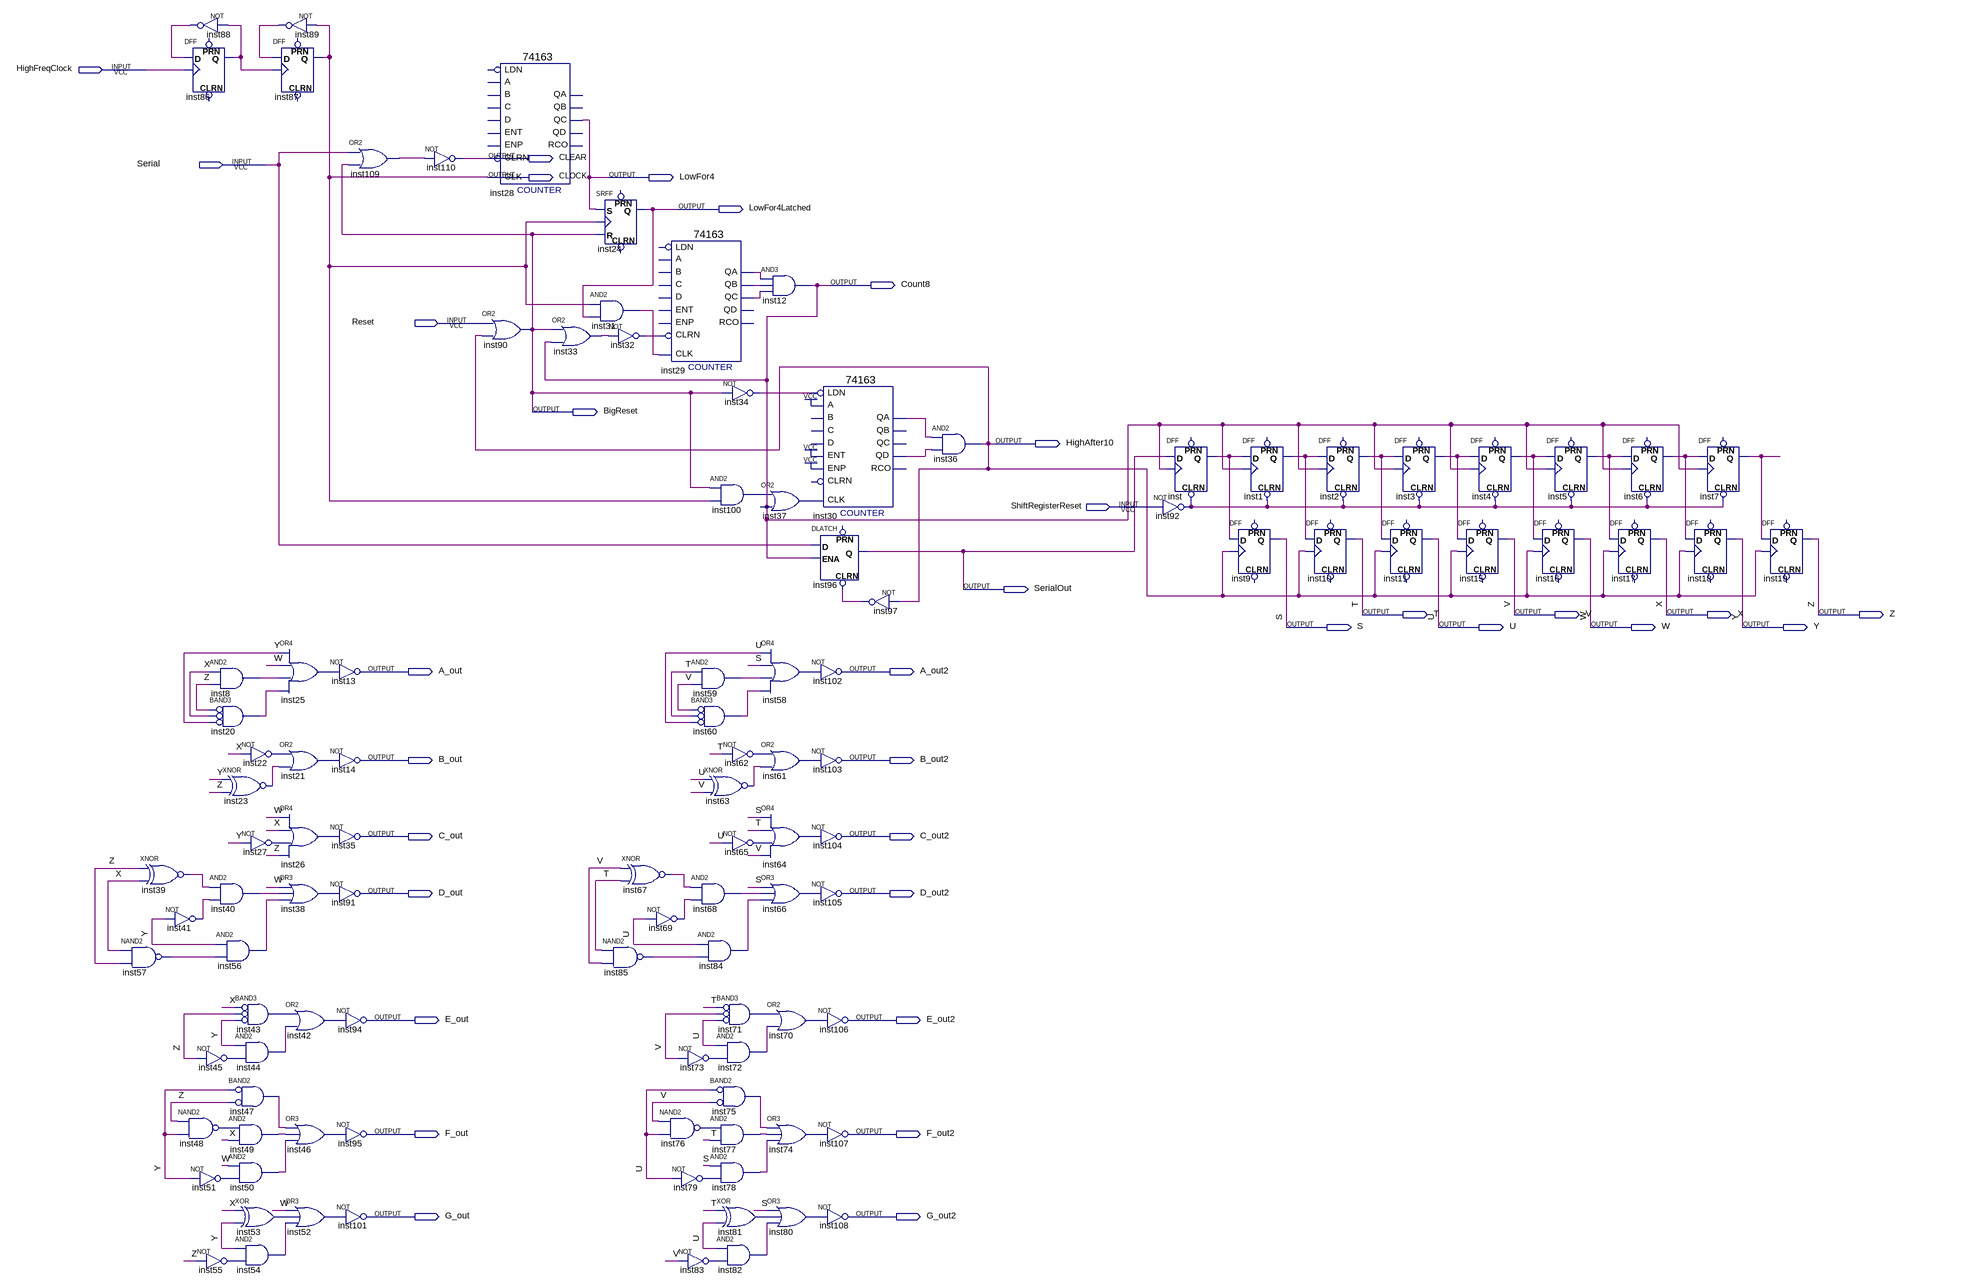
[diagram p0: schematic sheet]
// Quartus schematic WholeThing.bdf as structural Verilog: 108 symbols, 34 pins
module WholeThing (
  input  HighFreqClock,
  input  Serial,
  input  Reset,
  input  ShiftRegisterReset,
  output CLEAR,
  output CLOCK,
  output LowFor4,
  output LowFor4Latched,
  output Count8,
  output BigReset,
  output HighAfter10,
  output SerialOut,
  output T,
  output V,
  output X,
  output Z,
  output S,
  output U,
  output W,
  output Y,
  output A_out,
  output A_out2,
  output B_out,
  output B_out2,
  output C_out,
  output C_out2,
  output D_out,
  output D_out2,
  output E_out,
  output E_out2,
  output F_out,
  output F_out2,
  output G_out,
  output G_out2
);

  wire inst1_q, inst2_q, inst3_q, inst4_q, inst5_q, inst6_q, inst7_q, inst8_out, inst20_out, inst21_out,
       inst22_out, inst23_out, inst25_out, inst26_out, inst27_out, inst29_qa, inst29_qb, inst29_qc,
       inst30_qa, inst30_qd, inst31_out, inst32_out, inst33_out, inst34_out, inst37_out, inst38_out,
       inst39_out, inst40_out, inst41_out, inst42_out, inst43_out, inst44_out, inst45_out, inst46_out,
       inst47_out, inst48_out, inst49_out, inst50_out, inst51_out, inst52_out, inst53_out, inst54_out,
       inst55_out, inst56_out, inst57_out, inst58_out, inst59_out, inst60_out, inst61_out, inst62_out,
       inst63_out, inst64_out, inst65_out, inst66_out, inst67_out, inst68_out, inst69_out, inst70_out,
       inst71_out, inst72_out, inst73_out, inst74_out, inst75_out, inst76_out, inst77_out, inst78_out,
       inst79_out, inst80_out, inst81_out, inst82_out, inst83_out, inst84_out, inst85_out, inst86_q,
       inst88_out, inst89_out, inst92_out, inst97_out, inst100_out, inst109_out, inst_q;

  xnor inst39 (inst39_out, Z, X);
  nand inst57 (inst57_out, X, Z);
  not inst88 (inst88_out, inst86_q);
  DFF inst86 (.CLK(HighFreqClock), .D(inst88_out), .Q(inst86_q));  // open: CLRN, PRN
  not inst41 (inst41_out, Y);
  nand inst48 (inst48_out, Z, Y);
  not inst51 (inst51_out, Y);
  and inst8 (inst8_out, X, Z);
  and inst20 (inst20_out, ~Z, ~X, ~Y);  // BAND3
  not inst22 (inst22_out, X);
  xnor inst23 (inst23_out, Y, Z);
  not inst27 (inst27_out, Y);
  and inst40 (inst40_out, inst39_out, inst41_out);
  and inst56 (inst56_out, Y, inst57_out);
  and inst43 (inst43_out, ~X, ~Z, ~Y);  // BAND3
  and inst44 (inst44_out, Y, inst45_out);
  not inst45 (inst45_out, Z);
  and inst47 (inst47_out, ~Y, ~Z);  // BAND2
  and inst49 (inst49_out, inst48_out, X);
  and inst50 (inst50_out, W, inst51_out);
  xor inst53 (inst53_out, X, Y);
  and inst54 (inst54_out, Y, inst55_out);
  not inst55 (inst55_out, Z);
  not inst89 (inst89_out, CLOCK);
  DFF inst87 (.CLK(inst86_q), .D(inst89_out), .Q(CLOCK));  // open: CLRN, PRN
  or inst25 (inst25_out, Y, W, inst8_out, inst20_out);
  or inst21 (inst21_out, inst22_out, inst23_out);
  or inst26 (inst26_out, W, X, inst27_out, Z);
  or inst38 (inst38_out, W, inst40_out, inst56_out);
  or inst42 (inst42_out, inst43_out, inst44_out);
  or inst46 (inst46_out, inst47_out, inst49_out, inst50_out);
  or inst52 (inst52_out, W, inst53_out, inst54_out);
  not inst13 (A_out, inst25_out);
  not inst14 (B_out, inst21_out);
  not inst35 (C_out, inst26_out);
  not inst91 (D_out, inst38_out);
  not inst94 (E_out, inst42_out);
  not inst95 (F_out, inst46_out);
  not inst101 (G_out, inst52_out);
  or inst109 (inst109_out, Serial, BigReset);
  not inst110 (CLEAR, inst109_out);
  \74163  inst28 (.CLRN(CLEAR), .CLK(CLOCK), .QC(LowFor4));  // open: C, B, A, ENT, D, ENP, LDN, QA, QB, QD, RCO
  or inst90 (BigReset, Reset, HighAfter10);
  SRFF inst24 (.S(LowFor4), .R(BigReset), .CLK(CLOCK), .Q(LowFor4Latched));  // open: PRN, CLRN
  and inst31 (inst31_out, CLOCK, LowFor4Latched);
  or inst33 (inst33_out, BigReset, Count8);
  not inst32 (inst32_out, inst33_out);
  xnor inst67 (inst67_out, V, T);
  not inst69 (inst69_out, U);
  nand inst85 (inst85_out, T, V);
  \74163  inst29 (
    .CLRN(inst32_out), .CLK(inst31_out), .QA(inst29_qa), .QB(inst29_qb), .QC(inst29_qc));  // open: C, B, A, ENT, D, ENP, LDN, QD, RCO
  and inst59 (inst59_out, T, V);
  and inst60 (inst60_out, ~V, ~T, ~U);  // BAND3
  and inst68 (inst68_out, inst67_out, inst69_out);
  and inst84 (inst84_out, U, inst85_out);
  not inst73 (inst73_out, V);
  nand inst76 (inst76_out, V, U);
  not inst79 (inst79_out, U);
  not inst83 (inst83_out, V);
  not inst34 (inst34_out, BigReset);
  and inst100 (inst100_out, BigReset, CLOCK);
  not inst62 (inst62_out, T);
  xnor inst63 (inst63_out, U, V);
  not inst65 (inst65_out, U);
  and inst71 (inst71_out, ~T, ~V, ~U);  // BAND3
  and inst72 (inst72_out, U, inst73_out);
  and inst75 (inst75_out, ~U, ~V);  // BAND2
  and inst77 (inst77_out, inst76_out, T);
  and inst78 (inst78_out, S, inst79_out);
  xor inst81 (inst81_out, T, U);
  and inst82 (inst82_out, U, inst83_out);
  and inst12 (Count8, inst29_qa, inst29_qb, inst29_qc);
  or inst37 (inst37_out, inst100_out, Count8);
  or inst58 (inst58_out, U, S, inst59_out, inst60_out);
  or inst61 (inst61_out, inst62_out, inst63_out);
  or inst64 (inst64_out, S, T, inst65_out, V);
  or inst66 (inst66_out, S, inst68_out, inst84_out);
  or inst70 (inst70_out, inst71_out, inst72_out);
  or inst74 (inst74_out, inst75_out, inst77_out, inst78_out);
  or inst80 (inst80_out, S, inst81_out, inst82_out);
  \74163  inst30 (
    .A(1'b1), .ENT(1'b1), .CLK(inst37_out), .ENP(1'b1), .LDN(inst34_out), .QA(inst30_qa), .QD(inst30_qd));  // open: C, B, D, CLRN, QB, QC, RCO
  DLATCH inst96 (.CLRN(inst97_out), .D(Serial), .ENA(Count8), .Q(SerialOut));  // open: PRN
  not inst102 (A_out2, inst58_out);
  not inst103 (B_out2, inst61_out);
  not inst104 (C_out2, inst64_out);
  not inst105 (D_out2, inst66_out);
  not inst106 (E_out2, inst70_out);
  not inst107 (F_out2, inst74_out);
  not inst108 (G_out2, inst80_out);
  not inst97 (inst97_out, HighAfter10);
  and inst36 (HighAfter10, inst30_qa, inst30_qd);
  not inst92 (inst92_out, ShiftRegisterReset);
  DFF inst (.CLRN(inst92_out), .CLK(Count8), .D(SerialOut), .Q(inst_q));  // open: PRN
  DFF inst1 (.CLRN(inst92_out), .CLK(Count8), .D(inst_q), .Q(inst1_q));  // open: PRN
  DFF inst9 (.CLK(HighAfter10), .D(inst_q), .Q(S));  // open: CLRN, PRN
  DFF inst10 (.CLK(HighAfter10), .D(inst1_q), .Q(T));  // open: CLRN, PRN
  DFF inst2 (.CLRN(inst92_out), .CLK(Count8), .D(inst1_q), .Q(inst2_q));  // open: PRN
  DFF inst3 (.CLRN(inst92_out), .CLK(Count8), .D(inst2_q), .Q(inst3_q));  // open: PRN
  DFF inst11 (.CLK(HighAfter10), .D(inst2_q), .Q(U));  // open: CLRN, PRN
  DFF inst15 (.CLK(HighAfter10), .D(inst3_q), .Q(V));  // open: CLRN, PRN
  DFF inst4 (.CLRN(inst92_out), .CLK(Count8), .D(inst3_q), .Q(inst4_q));  // open: PRN
  DFF inst5 (.CLRN(inst92_out), .CLK(Count8), .D(inst4_q), .Q(inst5_q));  // open: PRN
  DFF inst16 (.CLK(HighAfter10), .D(inst4_q), .Q(W));  // open: CLRN, PRN
  DFF inst17 (.CLK(HighAfter10), .D(inst5_q), .Q(X));  // open: CLRN, PRN
  DFF inst6 (.CLRN(inst92_out), .CLK(Count8), .D(inst5_q), .Q(inst6_q));  // open: PRN
  DFF inst7 (.CLRN(inst92_out), .CLK(Count8), .D(inst6_q), .Q(inst7_q));  // open: PRN
  DFF inst18 (.CLK(HighAfter10), .D(inst6_q), .Q(Y));  // open: CLRN, PRN
  DFF inst19 (.CLK(HighAfter10), .D(inst7_q), .Q(Z));  // open: CLRN, PRN
endmodule
